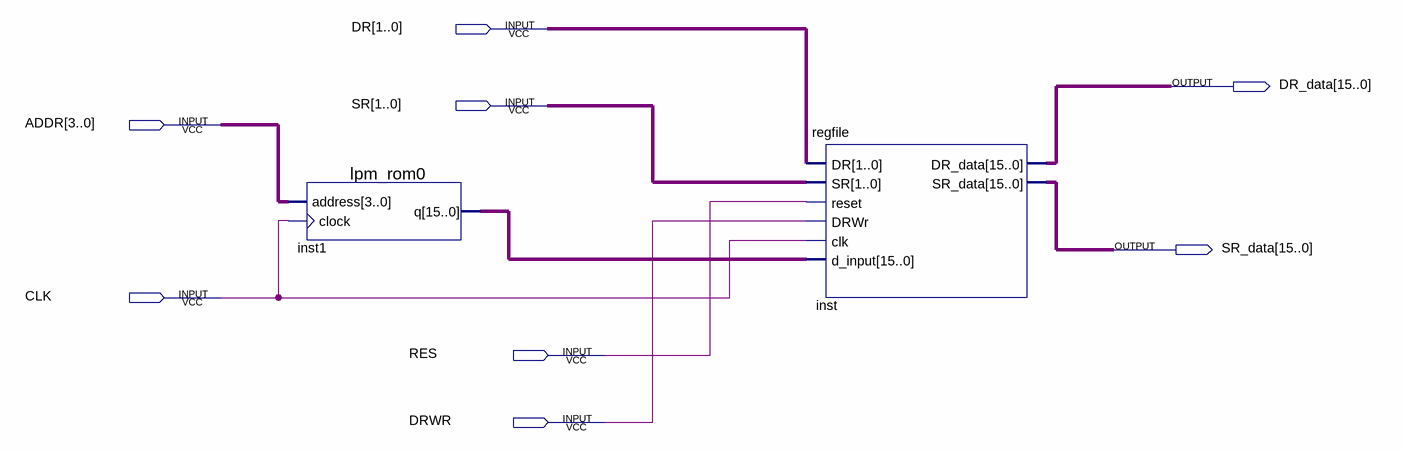
[diagram p0: schematic sheet]
// Quartus schematic Project_1.bdf as structural Verilog: 2 symbols, 8 pins
module Project_1 (
  input  [1:0] DR,
  input  [1:0] SR,
  input  [3:0] ADDR,
  input  CLK,
  input  RES,
  input  DRWR,
  output [15:0] DR_data,
  output [15:0] SR_data
);

  wire [15:0] inst1_q;

  lpm_rom0 inst1 (.address(ADDR), .clock(CLK), .q(inst1_q));
  regfile inst (
    .DR(DR), .SR(SR), .reset(RES), .DRWr(DRWR), .clk(CLK), .d_input(inst1_q), .DR_data(DR_data),
    .SR_data(SR_data));
endmodule
